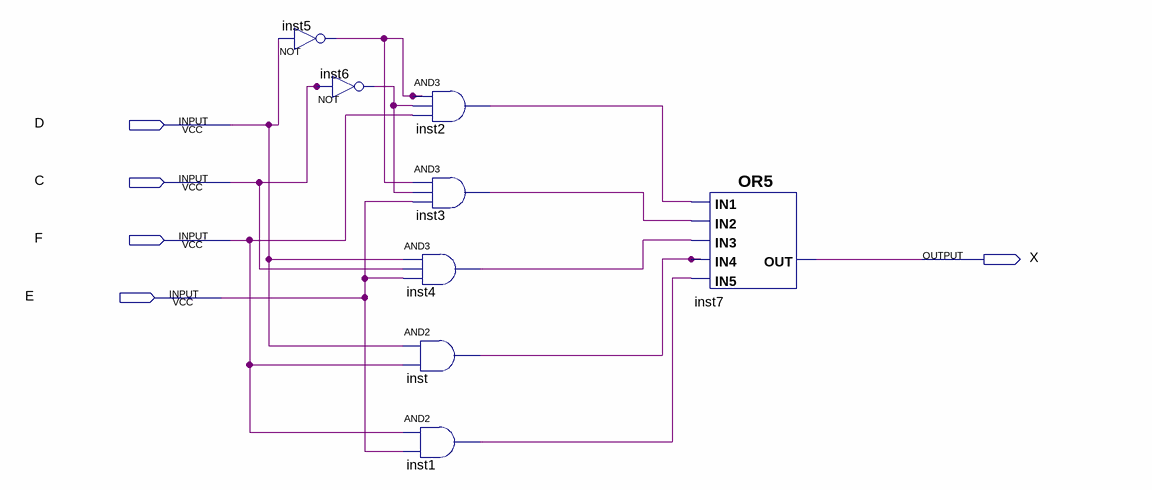
[diagram p0: schematic sheet]
// Quartus schematic KOMa0b1.bdf as structural Verilog: 8 symbols, 5 pins
module KOMa0b1 (
  input  D,
  input  C,
  input  F,
  input  E,
  output X
);

  wire inst1_out, inst2_out, inst3_out, inst4_out, inst5_out, inst6_out, inst_out;

  not inst5 (inst5_out, D);
  not inst6 (inst6_out, C);
  and inst4 (inst4_out, D, C, E);
  and inst (inst_out, D, F);
  and inst1 (inst1_out, F, E);
  and inst2 (inst2_out, inst5_out, inst6_out, F);
  and inst3 (inst3_out, inst5_out, inst6_out, E);
  or inst7 (X, inst2_out, inst3_out, inst4_out, inst_out, inst1_out);
endmodule
